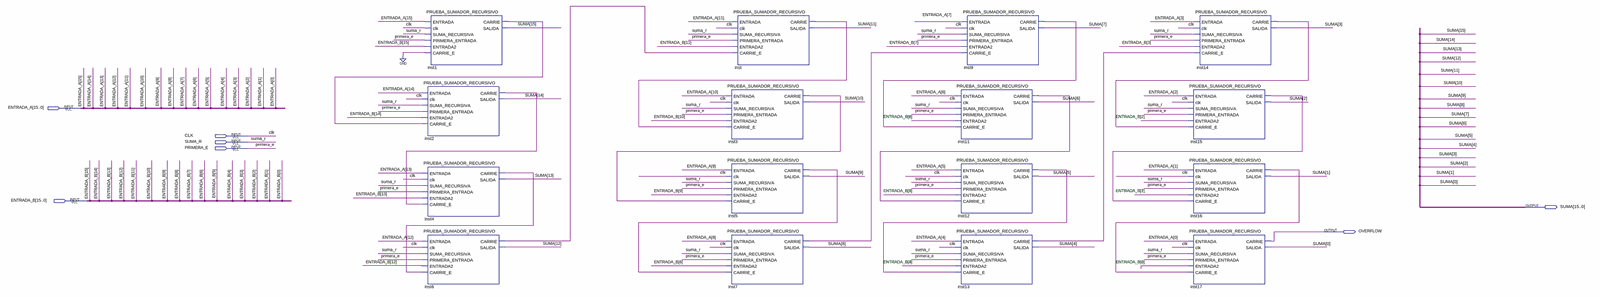
[diagram p0: schematic sheet, whole]
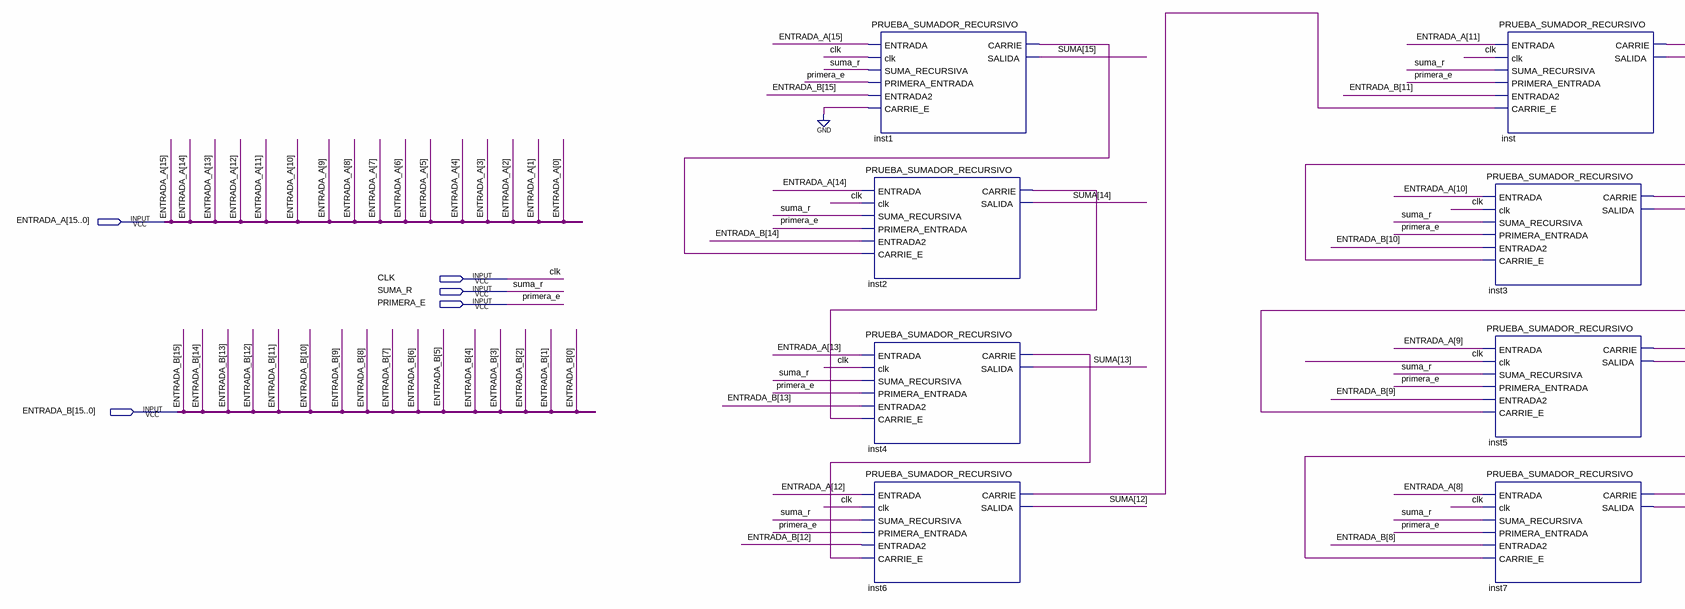
[diagram p1: schematic sheet, left part]
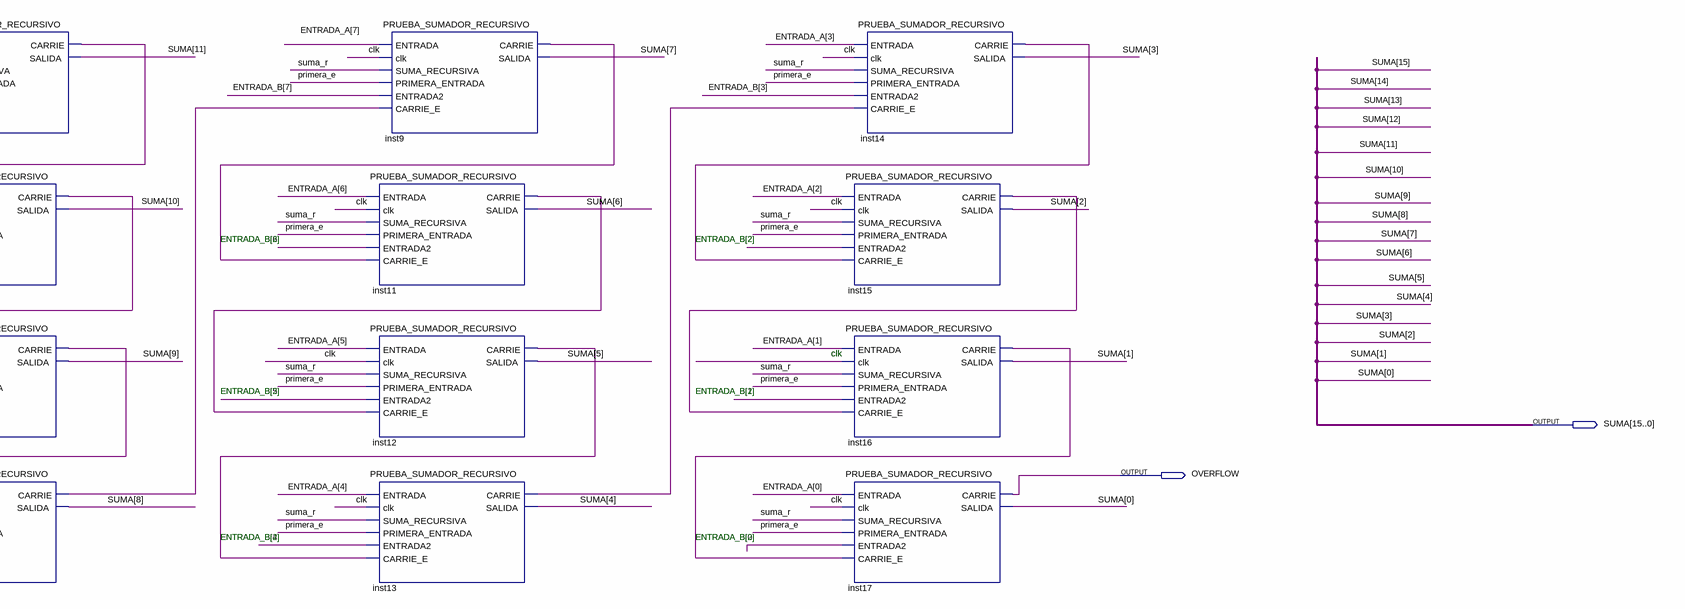
[diagram p2: schematic sheet, right part]
// Quartus schematic PRUEBA_SUMADOR_RUCURSIVO_4_BITS.bdf as structural Verilog: 16 symbols, 7 pins
module PRUEBA_SUMADOR_RUCURSIVO_4_BITS (
  input  [15:0] ENTRADA_A,
  input  CLK,
  input  SUMA_R,
  input  PRIMERA_E,
  input  [15:0] ENTRADA_B,
  output [15:0] SUMA,
  output OVERFLOW
);

  wire inst1_carrie, inst2_carrie, inst3_carrie, inst4_carrie, inst5_carrie, inst6_carrie, inst7_carrie,
       inst9_carrie, inst11_carrie, inst12_carrie, inst13_carrie, inst14_carrie, inst15_carrie,
       inst16_carrie, inst_carrie;

  PRUEBA_SUMADOR_RECURSIVO inst1 (
    .ENTRADA(ENTRADA_A[15]), .clk(CLK), .SUMA_RECURSIVA(SUMA_R), .PRIMERA_ENTRADA(PRIMERA_E),
    .ENTRADA2(ENTRADA_B[15]), .CARRIE_E(1'b0), .CARRIE(inst1_carrie), .SALIDA(SUMA[15]));
  PRUEBA_SUMADOR_RECURSIVO inst2 (
    .ENTRADA(ENTRADA_A[14]), .clk(CLK), .SUMA_RECURSIVA(SUMA_R), .PRIMERA_ENTRADA(PRIMERA_E),
    .ENTRADA2(ENTRADA_B[14]), .CARRIE_E(inst1_carrie), .CARRIE(inst2_carrie), .SALIDA(SUMA[14]));
  PRUEBA_SUMADOR_RECURSIVO inst4 (
    .ENTRADA(ENTRADA_A[13]), .clk(CLK), .SUMA_RECURSIVA(SUMA_R), .PRIMERA_ENTRADA(PRIMERA_E),
    .ENTRADA2(ENTRADA_B[13]), .CARRIE_E(inst2_carrie), .CARRIE(inst4_carrie), .SALIDA(SUMA[13]));
  PRUEBA_SUMADOR_RECURSIVO inst6 (
    .ENTRADA(ENTRADA_A[12]), .clk(CLK), .SUMA_RECURSIVA(SUMA_R), .PRIMERA_ENTRADA(PRIMERA_E),
    .ENTRADA2(ENTRADA_B[12]), .CARRIE_E(inst4_carrie), .CARRIE(inst6_carrie), .SALIDA(SUMA[12]));
  PRUEBA_SUMADOR_RECURSIVO inst (
    .ENTRADA(ENTRADA_A[11]), .clk(CLK), .SUMA_RECURSIVA(SUMA_R), .PRIMERA_ENTRADA(PRIMERA_E),
    .ENTRADA2(ENTRADA_B[11]), .CARRIE_E(inst6_carrie), .CARRIE(inst_carrie), .SALIDA(SUMA[11]));
  PRUEBA_SUMADOR_RECURSIVO inst3 (
    .ENTRADA(ENTRADA_A[10]), .clk(CLK), .SUMA_RECURSIVA(SUMA_R), .PRIMERA_ENTRADA(PRIMERA_E),
    .ENTRADA2(ENTRADA_B[10]), .CARRIE_E(inst_carrie), .CARRIE(inst3_carrie), .SALIDA(SUMA[10]));
  PRUEBA_SUMADOR_RECURSIVO inst5 (
    .ENTRADA(ENTRADA_A[9]), .clk(CLK), .SUMA_RECURSIVA(SUMA_R), .PRIMERA_ENTRADA(PRIMERA_E),
    .ENTRADA2(ENTRADA_B[9]), .CARRIE_E(inst3_carrie), .CARRIE(inst5_carrie), .SALIDA(SUMA[9]));
  PRUEBA_SUMADOR_RECURSIVO inst7 (
    .ENTRADA(ENTRADA_A[8]), .clk(CLK), .SUMA_RECURSIVA(SUMA_R), .PRIMERA_ENTRADA(PRIMERA_E),
    .ENTRADA2(ENTRADA_B[8]), .CARRIE_E(inst5_carrie), .CARRIE(inst7_carrie), .SALIDA(SUMA[8]));
  PRUEBA_SUMADOR_RECURSIVO inst9 (
    .ENTRADA(ENTRADA_A[7]), .clk(CLK), .SUMA_RECURSIVA(SUMA_R), .PRIMERA_ENTRADA(PRIMERA_E),
    .ENTRADA2(ENTRADA_B[7]), .CARRIE_E(inst7_carrie), .CARRIE(inst9_carrie), .SALIDA(SUMA[7]));
  PRUEBA_SUMADOR_RECURSIVO inst11 (
    .ENTRADA(ENTRADA_A[6]), .clk(CLK), .SUMA_RECURSIVA(SUMA_R), .PRIMERA_ENTRADA(PRIMERA_E),
    .ENTRADA2(ENTRADA_B[6]), .CARRIE_E(inst9_carrie), .CARRIE(inst11_carrie), .SALIDA(SUMA[6]));
  PRUEBA_SUMADOR_RECURSIVO inst12 (
    .ENTRADA(ENTRADA_A[5]), .clk(CLK), .SUMA_RECURSIVA(SUMA_R), .PRIMERA_ENTRADA(PRIMERA_E),
    .ENTRADA2(ENTRADA_B[5]), .CARRIE_E(inst11_carrie), .CARRIE(inst12_carrie), .SALIDA(SUMA[5]));
  PRUEBA_SUMADOR_RECURSIVO inst13 (
    .ENTRADA(ENTRADA_A[4]), .clk(CLK), .SUMA_RECURSIVA(SUMA_R), .PRIMERA_ENTRADA(PRIMERA_E),
    .ENTRADA2(ENTRADA_B[4]), .CARRIE_E(inst12_carrie), .CARRIE(inst13_carrie), .SALIDA(SUMA[4]));
  PRUEBA_SUMADOR_RECURSIVO inst15 (
    .ENTRADA(ENTRADA_A[2]), .clk(CLK), .SUMA_RECURSIVA(SUMA_R), .PRIMERA_ENTRADA(PRIMERA_E),
    .ENTRADA2(ENTRADA_B[2]), .CARRIE_E(inst14_carrie), .CARRIE(inst15_carrie), .SALIDA(SUMA[2]));
  PRUEBA_SUMADOR_RECURSIVO inst16 (
    .ENTRADA(ENTRADA_A[1]), .clk(CLK), .SUMA_RECURSIVA(SUMA_R), .PRIMERA_ENTRADA(PRIMERA_E),
    .ENTRADA2(ENTRADA_B[1]), .CARRIE_E(inst15_carrie), .CARRIE(inst16_carrie), .SALIDA(SUMA[1]));
  PRUEBA_SUMADOR_RECURSIVO inst17 (
    .ENTRADA(ENTRADA_A[0]), .clk(CLK), .SUMA_RECURSIVA(SUMA_R), .PRIMERA_ENTRADA(PRIMERA_E),
    .ENTRADA2(ENTRADA_B[0]), .CARRIE_E(inst16_carrie), .CARRIE(OVERFLOW), .SALIDA(SUMA[0]));
  PRUEBA_SUMADOR_RECURSIVO inst14 (
    .ENTRADA(ENTRADA_A[3]), .clk(CLK), .SUMA_RECURSIVA(SUMA_R), .PRIMERA_ENTRADA(PRIMERA_E),
    .ENTRADA2(ENTRADA_B[3]), .CARRIE_E(inst13_carrie), .CARRIE(inst14_carrie), .SALIDA(SUMA[3]));

  // Notes on the sheet:
  //   ENTRADA_B[2]
  //   ENTRADA_B[2]
  //   clk
  //   ENTRADA_B[2]
  //   ENTRADA_B[2]
  //   ENTRADA_B[2]
  //   ENTRADA_B[2]
endmodule
